# EAGLE design MainInterfaceBoard (EAGLE 8.5.0)
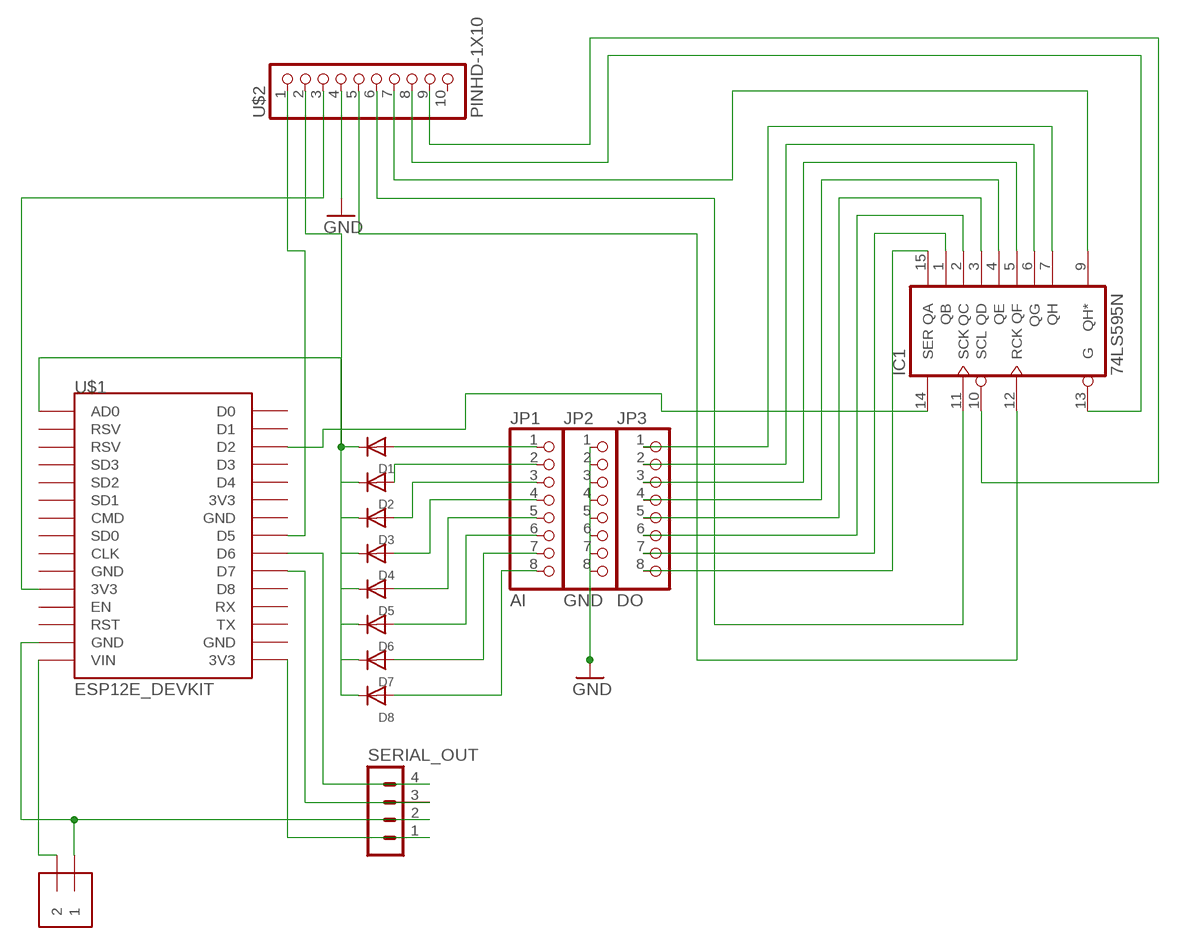
[diagram p0: schematic, sheet 1]

## Parts
D1  DIODEDO-1N4148  [DO-1N4148]
D2  DIODEDO-1N4148  [DO-1N4148]
D3  DIODEDO-1N4148  [DO-1N4148]
D4  DIODEDO-1N4148  [DO-1N4148]
D5  DIODEDO-1N4148  [DO-1N4148]
D6  DIODEDO-1N4148  [DO-1N4148]
D7  DIODEDO-1N4148  [DO-1N4148]
D8  DIODEDO-1N4148  [DO-1N4148]
IC1  74LS595N  [DIL16]
J2  1X2-3.5MM  [1X2-3.5MM]
JP1  AI  PINHD-1X8CLEANBIG  [1X08-CLEANBIG]
JP2  GND  PINHD-1X8CLEANBIG  [1X08-CLEANBIG]
JP3  DO  PINHD-1X8CLEANBIG  [1X08-CLEANBIG]
SERIAL_OUT  MA04-1  [MA04-1]
U$1  ESP12E_DEVKIT  [ESP12E_DEVKIT]
U$2  PINHD-1X10  [1X10-BIG]

## Nets
GND: JP2.1 JP2.2 JP2.3 JP2.4 JP2.5 JP2.6 JP2.7 JP2.8 U$2.4
N$1: IC1.15(QA) JP3.8
N$2: IC1.1(QB) JP3.7
N$3: IC1.2(QC) JP3.6
N$4: IC1.3(QD) JP3.5
N$5: IC1.4(QE) JP3.4
N$6: IC1.5(QF) JP3.3
N$7: IC1.6(QG) JP3.2
N$8: D1.C D2.C D3.C D4.C D5.C D6.C D7.C D8.C U$1.AD0 U$2.2
N$9: IC1.7(QH) JP3.1
N$10: D7.A JP1.7
N$11: D6.A JP1.6
N$12: D4.A JP1.4
N$13: D5.A JP1.5
N$14: D3.A JP1.3
N$15: D2.A JP1.2
N$16: D8.A JP1.8
N$17: D1.A JP1.1
N$18: IC1.9(QH*) U$2.7
N$19: U$1.D5 U$2.1
N$20: IC1.12(RCK) U$2.5
N$21: U$1.3V3@0(3V3) U$2.3
N$22: IC1.10(SCL) U$2.9
N$23: IC1.11(SCK) U$2.6
N$24: IC1.14(SER) U$1.D2
N$25: IC1.13(G) U$2.8
N$26: SERIAL_OUT.4 U$1.D6
N$27: SERIAL_OUT.3 U$1.D7
N$28: SERIAL_OUT.1 U$1.3V3@2(3V3)
N$29: J2.1 SERIAL_OUT.2 U$1.GND@1(GND)
N$30: J2.2 U$1.VIN
Unconnected: U$1.3V3@1(3V3) U$1.CLK U$1.CMD U$1.D0 U$1.D1 U$1.D3 U$1.D4 U$1.D8 U$1.EN U$1.GND@0(GND) U$1.GND@2(GND) U$1.GND@3(GND) U$1.RST U$1.RSV@0(RSV) U$1.RSV@1(RSV) U$1.RX U$1.SD0 U$1.SD1 U$1.SD2 U$1.SD3 U$1.TX U$2.10

## Power pins joined to a net without a drawn wire
GND: IC1.8(GND)
VCC: IC1.16(VCC)

## Library data of the parts
D1-D8 = adafruit:DIODE: Diode SMADIODE - SMA Surface Mount Package 20V 1A Schottky Diode Digikey: 641-1014-6-ND DO-1N4148 - Through Hole Small Current Diode SOD-123 20V 1 A (.5mV Vf) Schottky Diode - Digikey: MBRX120TPMSCT-ND SOD-323 10V 570mA (.38mV Vf, 3ns) Schottky Diode - Digikey: ZLLS410CT-ND SOD-523 30V 30mA Schottky Diode (RB751S-40TE61) - Digikey: RB751S-40TE61CT-ND SOT23-R/W - SOT23 Package (R = Solder Paste/Reflow Ovens, W = Hand-Soldering) BAT54Film 40V 300mA - Digikey: 497-7162-1-ND
IC1 = 74xx-us:74*595: 8-bit SHIFT REGISTER, output latch
J2 = adafruit:1X2: 3.5mm Terminal block http://www.ladyada.net/library/pcb/eaglelibrary.html
JP1-JP3 = adafruit:PINHD-1X8: PIN HEADER
SERIAL_OUT = con-lstb:MA04-1: PIN HEADER; OC_FARNELL: unknown; OC_NEWARK: unknown
U$1 = ESP12E_DEVKIT:ESP12E_DEVKIT: ESP12E DEVKIT BOARD
U$2 = adafruit:PINHD-1X10: Pin header 1x10 0.1" spacing With round pins

## Board
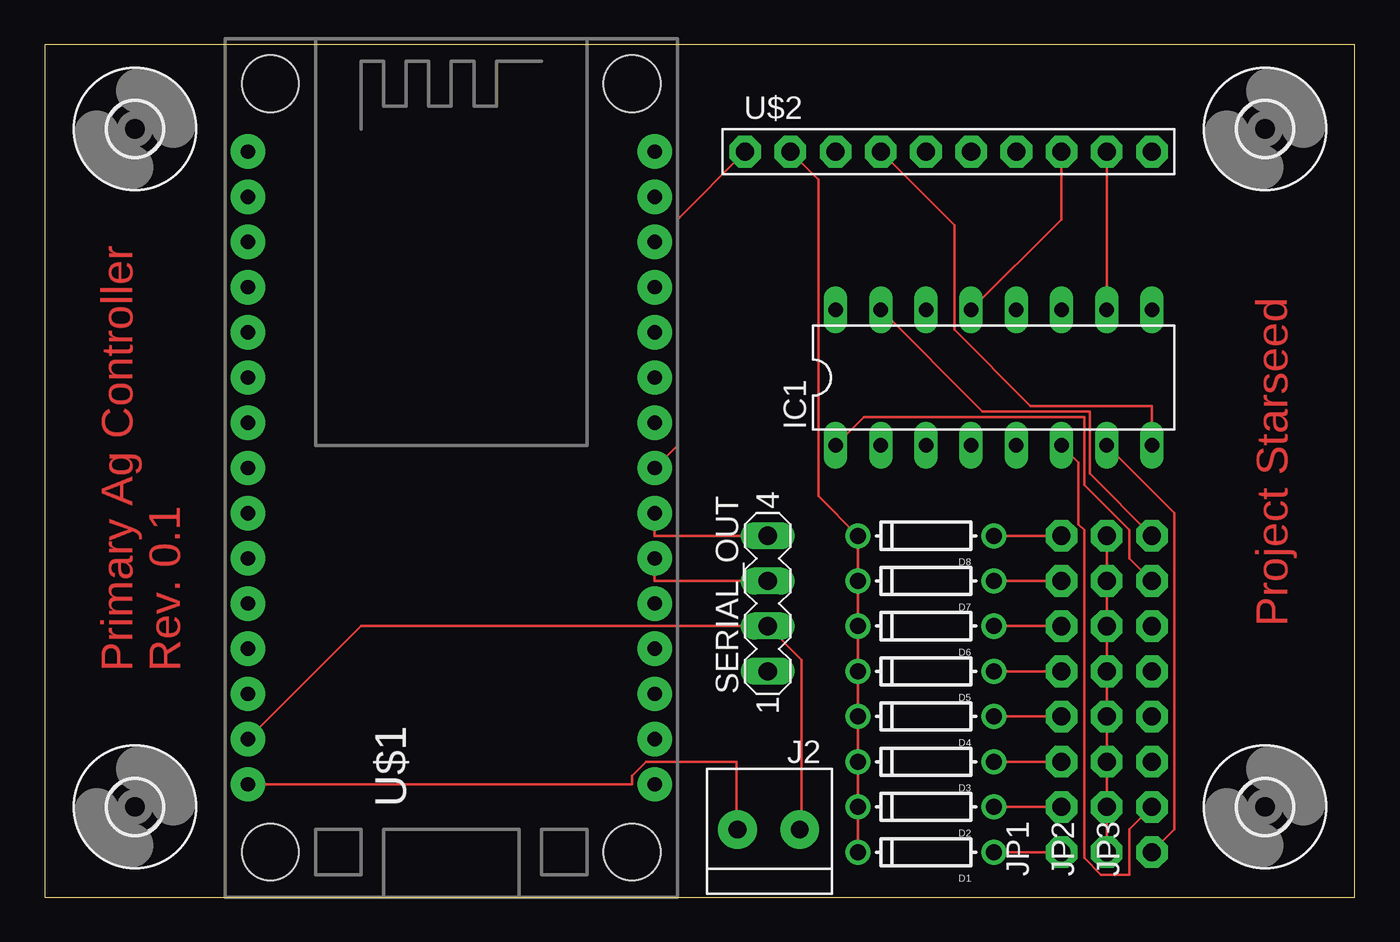
[diagram p1: board, top side]
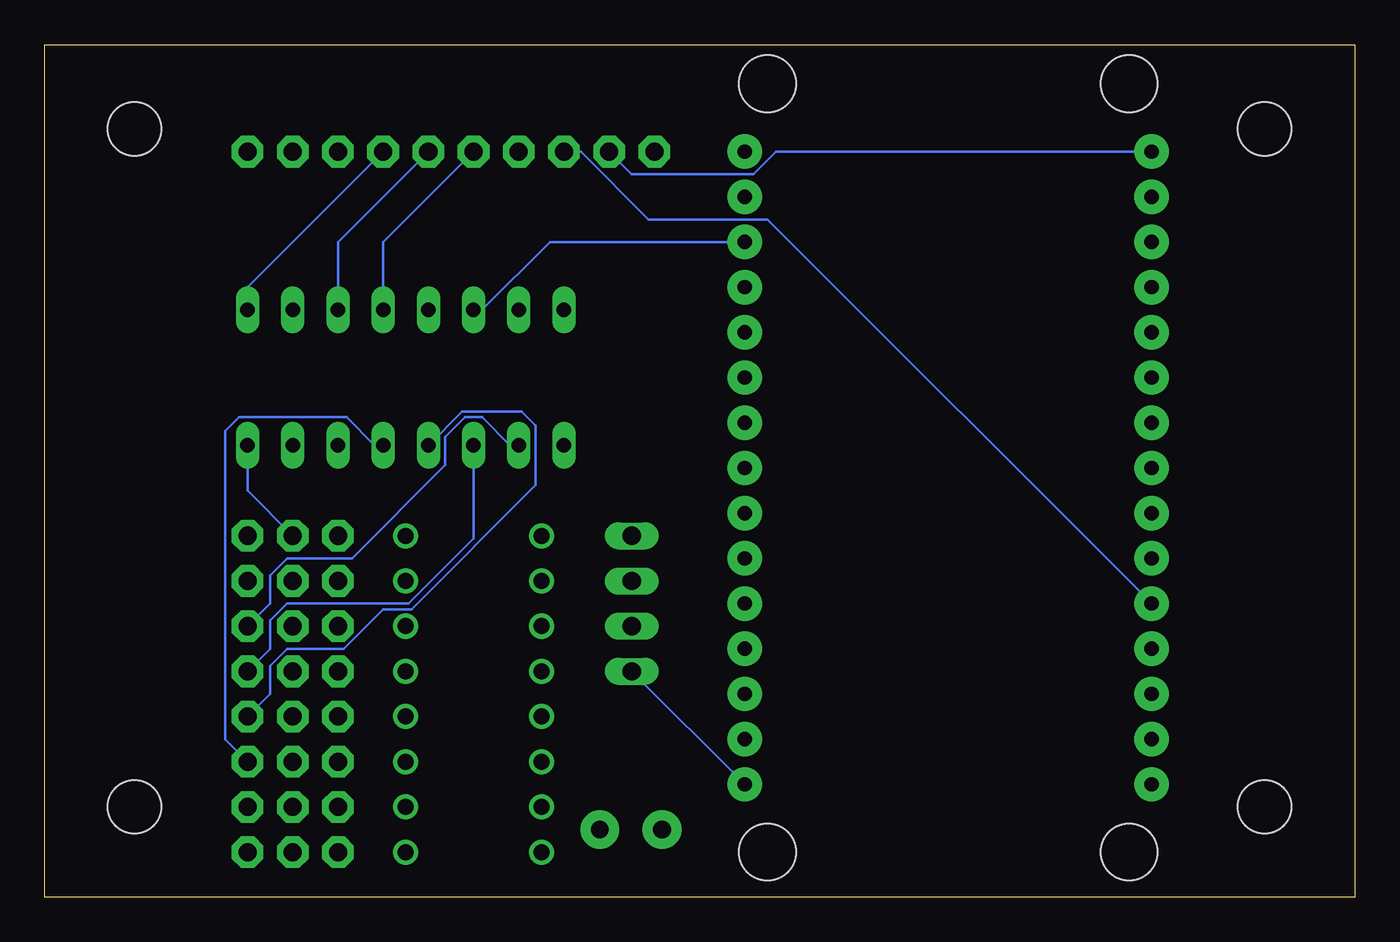
[diagram p2: board, bottom side, seen from below]

Size 73.64 x 47.93 mm. Coordinates in mm from the lower left corner, seen from the top.
Outline: 0,0 73.64,0 73.64,47.93 0,47.93 0,0
Copper layers (1*16): Top 0.035mm / dielectric 1.5mm / Bottom 0.035mm
Design rules "default": minimum track width 6mil, minimum drill 0.35mm, track to track 6mil, track to pad 6mil, pad to pad 6mil, via to via 6mil, smd to smd 6mil, copper to edge 40mil, drill to drill 6mil, minimum pad ring 10mil, minimum via ring 8mil, stop-mask expansion 4mil, vias tented up to drill 0mil, thermal gap 10mil

### Footprints (pad centres in the part's own frame; a part is rotated, then mirrored left to right if it is on the bottom)
DO-1N4148 = drill 0.9: A -3.81,0; C 3.81,0
DIL16 = drill 0.813 long: 1 -8.89,-3.81; 2 -6.35,-3.81; 3 -3.81,-3.81; 4 -1.27,-3.81; 5 1.27,-3.81; 6 3.81,-3.81; 7 6.35,-3.81; 8 8.89,-3.81; 9 8.89,3.81; 10 6.35,3.81; 11 3.81,3.81; 12 1.27,3.81; 13 -1.27,3.81; 14 -3.81,3.81; 15 -6.35,3.81; 16 -8.89,3.81
1X2-3.5MM = drill 1 pad 2.184: 1 1.8,0; 2 -1.7,0
1X08-CLEANBIG = drill 1.016 pad 1.778 octagon: 1 -8.89,0; 2 -6.35,0; 3 -3.81,0; 4 -1.27,0; 5 1.27,0; 6 3.81,0; 7 6.35,0; 8 8.89,0
MA04-1 = drill 1.016 long: 1 -3.81,0; 2 -1.27,0; 3 1.27,0; 4 3.81,0
ESP12E_DEVKIT = drill 0.8 pad 1.93: 3V3@0 -11.43,-7.62; 3V3@1 11.43,5.08; 3V3@2 11.43,-17.78; AD0 -11.43,17.78; CLK -11.43,-2.54; CMD -11.43,2.54; D0 11.43,17.78; D1 11.43,15.24; D2 11.43,12.7; D3 11.43,10.16; D4 11.43,7.62; D5 11.43,0; D6 11.43,-2.54; D7 11.43,-5.08; D8 11.43,-7.62; EN -11.43,-10.16; GND@0 -11.43,-5.08; GND@1 -11.43,-15.24; GND@2 11.43,2.54; GND@3 11.43,-15.24; RST -11.43,-12.7; RSV@0 -11.43,15.24; RSV@1 -11.43,12.7; RX 11.43,-10.16; SD0 -11.43,0; SD1 -11.43,5.08; SD2 -11.43,7.62; SD3 -11.43,10.16; TX 11.43,-12.7; VIN -11.43,-17.78 | hole 3.2: -10.16,21.59; 10.16,21.59; 10.16,-21.59; -10.16,-21.59
1X10-BIG = drill 1.016 pad 1.778 octagon: 1 -11.43,0; 2 -8.89,0; 3 -6.35,0; 4 -3.81,0; 5 -1.27,0; 6 1.27,0; 7 3.81,0; 8 6.35,0; 9 8.89,0; 10 11.43,0
3,0 = hole 3: 0,0

### Placement (x,y rotation side)
D1  49.53,2.54 180 top
D2  49.53,5.08 180 top
D3  49.53,7.62 180 top
D4  49.53,10.16 180 top
D5  49.53,12.7 180 top
D6  49.53,15.24 180 top
D7  49.53,17.78 180 top
D8  49.53,20.32 180 top
IC1  53.34,29.21 0 top
J2  40.64,3.81 0 top
JP1  57.15,11.43 90 top
JP2  59.69,11.43 90 top
JP3  62.23,11.43 90 top
SERIAL_OUT  40.64,16.51 90 top
U$1  22.86,24.13 0 top
U$2  50.8,41.91 0 top
U$3  [3,0]  68.58,43.18 0 top
U$4  [3,0]  68.58,5.08 0 top
U$5  [3,0]  5.08,5.08 0 top
U$6  [3,0]  5.08,43.18 0 top

### Tracks (layer width: path | path; a pad name or v marks a point on that pad's centre or on a via)
GND
  Top 0.152: JP2.1 JP2.2 JP2.3 JP2.4 JP2.5 JP2.6 JP2.7 JP2.8 | U$2.4 51.12,37.78 51.12,31.91 55.4,27.62 62.23,27.62 IC1.8
  Bottom 0.152: IC1.8 62.23,22.86 JP2.8
N$1
  Top 0.152: IC1.15 52.7,27.3 58.74,27.3 58.74,23.81 JP3.8
N$2
  Top 0.152: IC1.1 46.04,26.99 58.42,26.99 58.42,23.18 60.96,20.64 60.96,19.05 JP3.7
N$3
  Bottom 0.152: IC1.2 47.47,25.4 49.05,26.99 50.01,26.99 51.12,25.88 51.12,24.29 56.36,19.05 60.01,19.05 60.96,18.1 60.96,16.51 JP3.6
N$4
  Bottom 0.152: IC1.3 49.53,20.16 53.18,16.51 60.01,16.51 60.96,15.56 60.96,13.97 JP3.5
N$5
  Bottom 0.152: IC1.4 50.16,27.3 46.83,27.3 46.04,26.51 46.04,23.18 53.02,16.19 54.61,16.19 56.83,13.97 60.01,13.97 60.96,13.02 60.96,11.43 JP3.4
N$6
  Bottom 0.152: IC1.5 55.09,25.4 56.67,26.99 62.71,26.99 63.5,26.19 63.5,8.89 JP3.3
N$7
  Top 0.152: IC1.6 58.1,24.45 58.1,20.95 58.42,20.64 58.42,2.22 59.37,1.27 60.96,1.27 60.96,3.81 JP3.2
N$8
  Top 0.152: D1.C D2.C D3.C D4.C D5.C D6.C D7.C D8.C 43.5,22.54 43.5,40.32 U$2.2
  Bottom 0.152: U$1.AD0 32.54,41.91 33.81,40.64 40.64,40.64 U$2.2
N$9
  Top 0.152: IC1.7 63.5,21.59 63.5,3.81 JP3.1
N$10
  Top 0.152: JP1.7 D7.A
N$11
  Top 0.152: JP1.6 D6.A
N$12
  Top 0.152: JP1.4 D4.A
N$13
  Top 0.152: JP1.5 D5.A
N$14
  Top 0.152: JP1.3 D3.A
N$15
  Top 0.152: JP1.2 D2.A
N$16
  Top 0.152: JP1.8 D8.A
N$17
  Top 0.152: JP1.1 D1.A
N$18
  Bottom 0.152: IC1.9 62.23,34.29 U$2.7
N$19
  Top 0.152: U$2.1 35.56,38.1 35.56,25.4 U$1.D5
N$20
  Bottom 0.152: IC1.12 54.61,36.83 U$2.5
N$21
  Bottom 0.152: U$2.3 43.5,41.91 39.69,38.1 33.02,38.1 U$1.3V3@0
N$22
  Top 0.152: U$2.9 IC1.10
N$23
  Bottom 0.152: IC1.11 57.15,36.83 U$2.6
N$24
  Bottom 0.152: IC1.14 49.05,33.02 45.24,36.83 U$1.D2
N$25
  Top 0.152: IC1.13 57.15,38.1 U$2.8
N$26
  Top 0.152: SERIAL_OUT.4 34.29,20.32 U$1.D6
N$27
  Top 0.152: SERIAL_OUT.3 34.29,17.78 U$1.D7
N$28
  Bottom 0.152: U$1.3V3@2 SERIAL_OUT.1
N$29
  Top 0.152: J2.1 42.55,3.81 42.55,13.34 SERIAL_OUT.2 17.78,15.24 U$1.GND@1
N$30
  Top 0.152: U$1.VIN 33.02,6.35 33.02,6.83 33.81,7.62 38.89,7.62 38.89,3.81 J2.2

### Text on the board
Top: Project Starseed | Primary Ag Controller / Rev. 0.1